# Altium schematic sheet CME-USB-JTAG_Lite.SchDoc
size A4
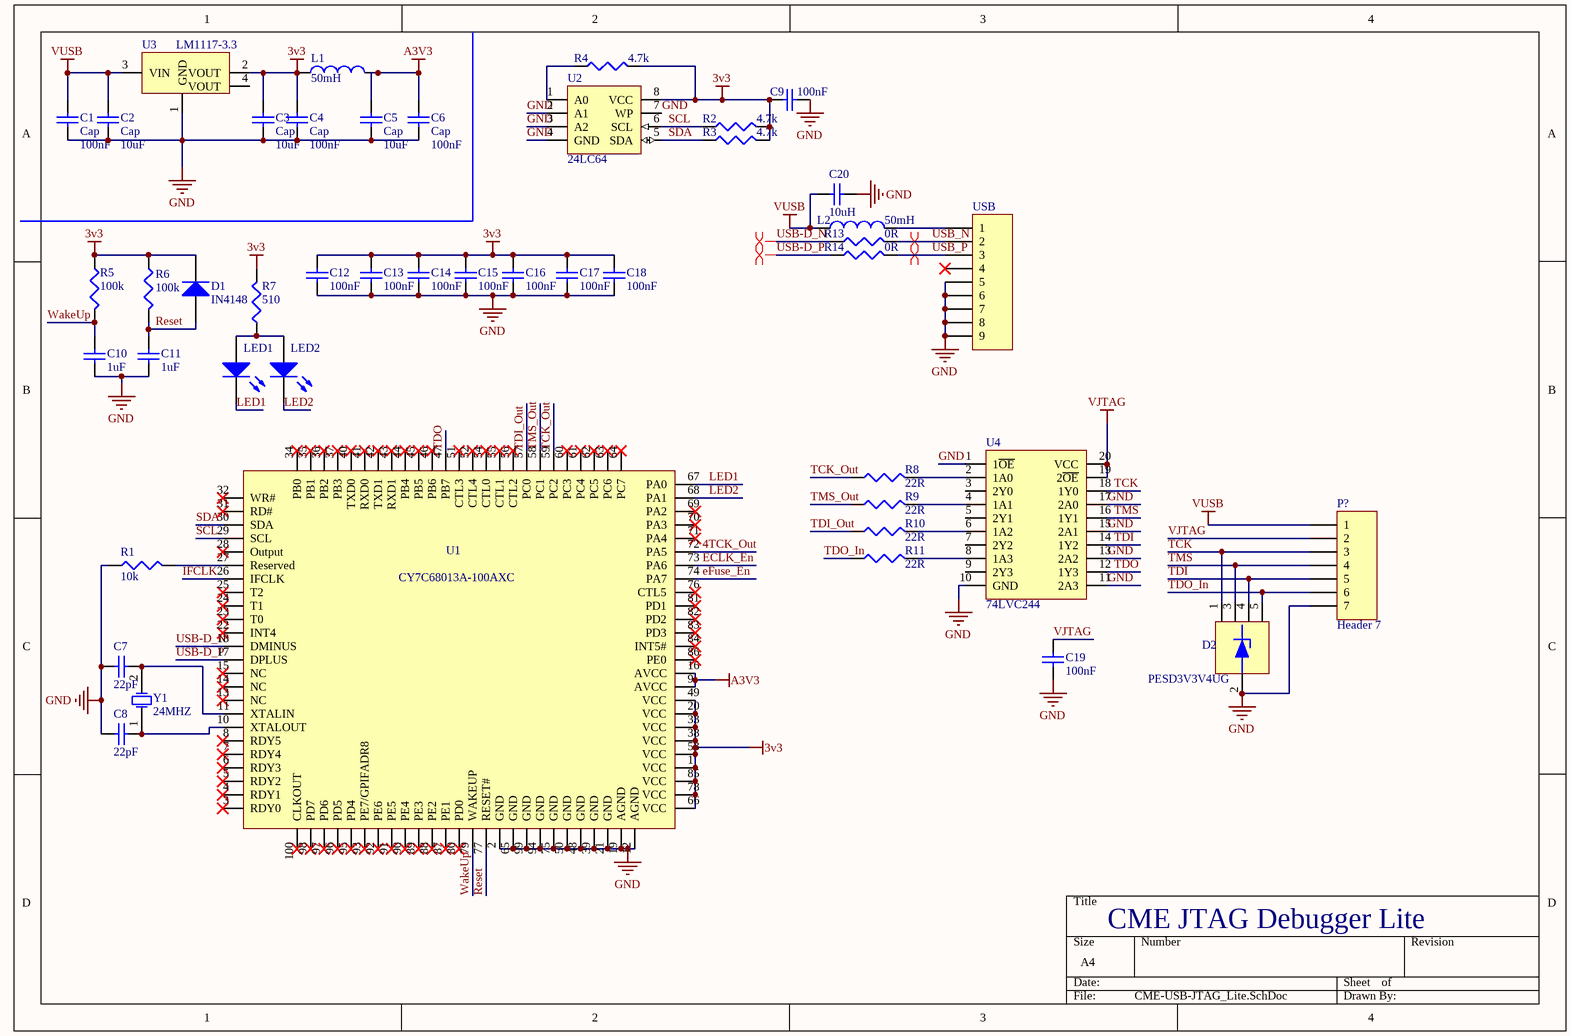
[diagram p0: CME-USB-JTAG_Lite.SchDoc]

## Parts
C1  Cap  value 100nF  [6-0805_N]
C2  Cap  value 10uF  [6-0805_N]
C3  Cap  value 10uF  [6-0805_N]
C4  Cap  value 100nF  [6-0805_N]
C5  Cap  value 10uF  [6-0805_N]
C6  Cap  value 100nF  [6-0805_N]
C7  value 22pF  [6-0805_N]  (hidden comment: Cap)
C8  value 22pF  [6-0805_N]  (hidden comment: Cap)
C9  value 100nF  [6-0805_N]  (hidden comment: Cap)
C10  value 1uF  [6-0805_N]  (hidden comment: Cap)
C11  value 1uF  [6-0805_N]  (hidden comment: Cap)
C12  value 100nF  [6-0805_N]  (hidden comment: Cap)
C13  value 100nF  [6-0805_N]  (hidden comment: Cap)
C14  value 100nF  [6-0805_N]  (hidden comment: Cap)
C15  value 100nF  [6-0805_N]  (hidden comment: Cap)
C16  value 100nF  [6-0805_N]  (hidden comment: Cap)
C17  value 100nF  [6-0805_N]  (hidden comment: Cap)
C18  value 100nF  [6-0805_N]  (hidden comment: Cap)
C19  value 100nF  [6-0805_N]  (hidden comment: Cap)
C20  value 10uH  [6-0805_N]  (hidden comment: Cap)
D1  IN4148  [6-0805_Diode]
D2  PESD3V3V4UG  [SOT5N-65P210X110]
L1  value 50mH  [6-0805_N]  (hidden comment: Inductor)
L2  value 50mH  [6-0805_N]  (hidden comment: Inductor)
LED1  LED2  [6-0805_Diode]  (value not drawn)
LED2  LED2  [6-0805_Diode]  (value not drawn)
P?  Header 7  [HDR1X7]
R1  value 10k  [6-0805_N]  (hidden comment: Res3)
R2  value 4.7k  [6-0805_N]  (hidden comment: Res3)
R3  value 4.7k  [6-0805_N]  (hidden comment: Res3)
R4  value 4.7k  [6-0805_N]  (hidden comment: Res3)
R5  value 100k  [6-0805_N]  (hidden comment: Res3)
R6  value 100k  [6-0805_N]  (hidden comment: Res3)
R7  value 510  [6-0805_N]  (hidden comment: Res3)
R8  value 22R  [6-0805_N]  (hidden comment: Res3)
R9  value 22R  [6-0805_N]  (hidden comment: Res3)
R10  value 22R  [6-0805_N]  (hidden comment: Res3)
R11  value 22R  [6-0805_N]  (hidden comment: Res3)
R13  value 0R  [6-0805_N]  (hidden comment: Res3)
R14  value 0R  [6-0805_N]  (hidden comment: Res3)
U1  CY7C68013A-100AXC  [TQFP100N-65P1600X2200X160]
U2  24LC64  [SOP8N-127P600X200]
U3  LM1117-3.3  [SOT223_N]
U4  74LVC244  [SOP20N-127P1030X265]
USB  Header 9  [MicroUSB]  (value not drawn)
Y1  24MHZ  [XTAL]

## Nets
3v3: C3.2 C4.2 C9.1 C12.2 C13.2 C14.2 C15.2 C16.2 C17.2 C18.2 D1.2(K) L1.1 R2.2 R3.2 R4.2 R5.1 R6.1 R7.2 U1.1(VCC) U1.20(VCC) U1.33(VCC) U1.38(VCC) U1.49(VCC) U1.53(VCC) U1.66(VCC) U1.78(VCC) U1.85(VCC) U2.8(VCC) U3.2(VOUT)
A3V3: C5.2 C6.2 L1.2 U1.9(AVCC) U1.16(AVCC)
GND: C1.1 C2.1 C3.1 C4.1 C5.1 C6.1 C7.1 C8.1 C9.2 C10.1 C11.1 C12.1 C13.1 C14.1 C15.1 C16.1 C17.1 C18.1 C19.1 C20.2 D2.2(?) P?.7 R1.1 U1.2(GND) U1.12(AGND) U1.19(AGND) U1.21(GND) U1.39(GND) U1.48(GND) U1.50(GND) U1.65(GND) U1.75(GND) U1.94(GND) U1.99(GND) U2.2(A1) U2.3(A2) U2.4(GND) U2.7(WP) U3.1(GND) U4.1(1~{OE}) U4.10(GND) U4.11(2A3) U4.13(2A2) U4.15(2A1) U4.17(2A0) USB.5 USB.6 USB.7 USB.8 USB.9
VJTAG: C19.2 P?.2 U4.19(2~{OE}) U4.20(VCC)
VUSB: C1.2 C2.2 C20.1 L2.1 P?.1 U3.3(VIN)
4TCK_Out: U1.72(PA5)
ECLK_En: U1.73(PA6)
eFuse_En: U1.74(PA7)
IFCLK: U1.26(IFCLK)
LED1: LED1.2(K) U1.67(PA0)
LED2: LED2.2(K) U1.68(PA1)
Reset: C11.2 D1.1(A) R6.2 U1.77(RESET#)
SCL: R2.1 U1.29(SCL) U2.6(SCL)
SDA: R3.1 U1.30(SDA) U2.5(SDA)
TCK: D2.1(?) P?.3 U4.18(1Y0)
TCK_Out: R8.1 U1.59(PC2)
TDI: D2.4(?) P?.5 U4.14(1Y2)
TDI_Out: R10.1 U1.57(PC0)
TDO: U1.47(PB7) U4.12(1Y3)
TDO_In: D2.5(?) P?.6 R11.1
TMS: D2.3(?) P?.4 U4.16(1Y1)
TMS_Out: R9.1 U1.58(PC1)
USB-D_N: R13.1 U1.18(DMINUS)
USB-D_P: R14.1 U1.17(DPLUS)
USB_N: R13.2 USB.2
USB_P: R14.2 USB.3
WakeUp: C10.2 R5.2 U1.79(WAKEUP)
NetC7_2: C7.2 U1.11(XTALIN) Y1.2(OSC2)
NetC8_2: C8.2 U1.10(XTALOUT) Y1.1(OSC1)
NetL2_2: L2.2 USB.1
NetLED1_1: LED1.1(A) LED2.1(A) R7.1
NetR1_2: R1.2 U1.27(Reserved)
NetR4_1: R4.1 U2.1(A0)
NetR8_2: R8.2 U4.2(1A0)
NetR9_2: R9.2 U4.4(1A1)
NetR10_2: R10.2 U4.6(1A2)
NetR11_2: R11.2 U4.8(1A3)

Not connected (* = marked no-connect by the designer): U1 3(RDY0)* 4(RDY1)* 5(RDY2)* 6(RDY3)* 7(RDY4)* 8(RDY5)* 13(NC)* 14(NC)* 15(NC)* 22(INT4)* 23(T0)* 24(T1)* 25(T2)* 28(Output)* 31(RD#)* 32(WR#)* 34(PB0)* 35(PB1)* 36(PB2)* 37(PB3)* 40(TXD0)* 41(RXD0)* 42(TXD1)* 43(RXD1)* 44(PB4)* 45(PB5)* 46(PB6)* 51(CTL3)* 52(CTL4)* 54(CTL0)* 55(CTL1)* 56(CTL2)* 60(PC3)* 61(PC4)* 62(PC5)* 63(PC6)* 64(PC7)* 69(PA2)* 70(PA3)* 71(PA4)* 76(CTL5)* 80(PD0)* 81(PD1)* 82(PD2)* 83(PD3)* 84(INT5#)* 86(PE0)* 87(PE1)* 88(PE2)* 89(PE3)* 90(PE4)* 91(PE5)* 92(PE6)* 93(PE7/GPIFADR8)* 95(PD4)* 96(PD5)* 97(PD6)* 98(PD7)* 100(CLKOUT)*; U3 4(VOUT); U4 3(2Y0) 5(2Y1) 7(2Y2) 9(2Y3); USB 4*

## Layout directives
differential pair: USB-D_N, USB-D_P, USB_N, USB_P

## Notes on the sheet
- CME JTAG Debugger Lite

## Library data of the parts
C1-C20 = Cap: Capacitor; Published: 8-Jun-2000; LatestRevisionDate: 17-Jul-2002; LatestRevisionNote: Re-released for DXP Platform.; PackageReference: RAD-0.3; Publisher: Altium Limited; PackageDescription: Radial Cap, Thru-Hole; 2 Leads; 0.3 in Pin Spacing
D1 = Diode: Default Diode; Published: 8-Jun-2000; LatestRevisionDate: 17-Jul-2002; LatestRevisionNote: Re-released for DXP Platform.; PackageVersion: Sep-1996; PackageReference: SMC; Publisher: Altium Limited; PackageDescription: DO-214-AB/SMC; 2 C-Bend Leads; Body 7.9 x 5.9 mm, inc. leads (LxW); Code_JEDEC: DO-214-AB
D2 = ESD_Diode x4
L1 L2 = Inductor: Code_IEC: 1005; Published: 8-Jun-2000; LatestRevisionDate: 29-May-2009; LatestRevisionNote: IPC-7351 Footprint Added.; PackageReference: 0402-A; Publisher: Altium Limited; PackageDescription: Chip Inductor; Code_JEITA: 0402
LED1 LED2 = LED2: Typical RED, GREEN, YELLOW, AMBER GaAs LED; Published: 8-Jun-2000; LatestRevisionDate: 17-Jul-2002; LatestRevisionNote: Re-released for DXP Platform.; PackageVersion: Feb-2002; PackageReference: 3.2X1.6X1.1; Publisher: Altium Limited; PackageDescription: SM LED; 2 Flat Leads
P? = Header 7: Header, 7-Pin; LatestRevisionDate: 17-Jul-2002; LatestRevisionNote: Re-released for DXP Platform.; Publisher: Altium Limited
R1-R11 R13 R14 = Res3: Resistor; Published: 8-Jun-2000; LatestRevisionDate: 29-May-2009; LatestRevisionNote: IPC-7351 Footprint Added.; PackageReference: J1-0603; Publisher: Altium Limited; PackageDescription: Chip Resistor
U2 = 24XXxx
U3 = LM1117
U4 = 74xx244
USB = Header 9: Header, 9-Pin; LatestRevisionDate: 17-Jul-2002; LatestRevisionNote: Re-released for DXP Platform.; Publisher: Altium Limited
Y1 = XTAL: Crystal Oscillator; Published: 8-Jun-2000; LatestRevisionDate: 17-Jul-2002; LatestRevisionNote: Re-released for DXP Platform.; PackageReference: R38; Publisher: Altium Limited; PackageDescription: Crystal, Thru-Hole; 2 Leads; Body 3.1 x 8.2 mm (Dia.xH)